# Altium project MPAXFC_00.PrjPcb (part 2 of 2)

## Sheet DEBUG.SchDoc
size A4
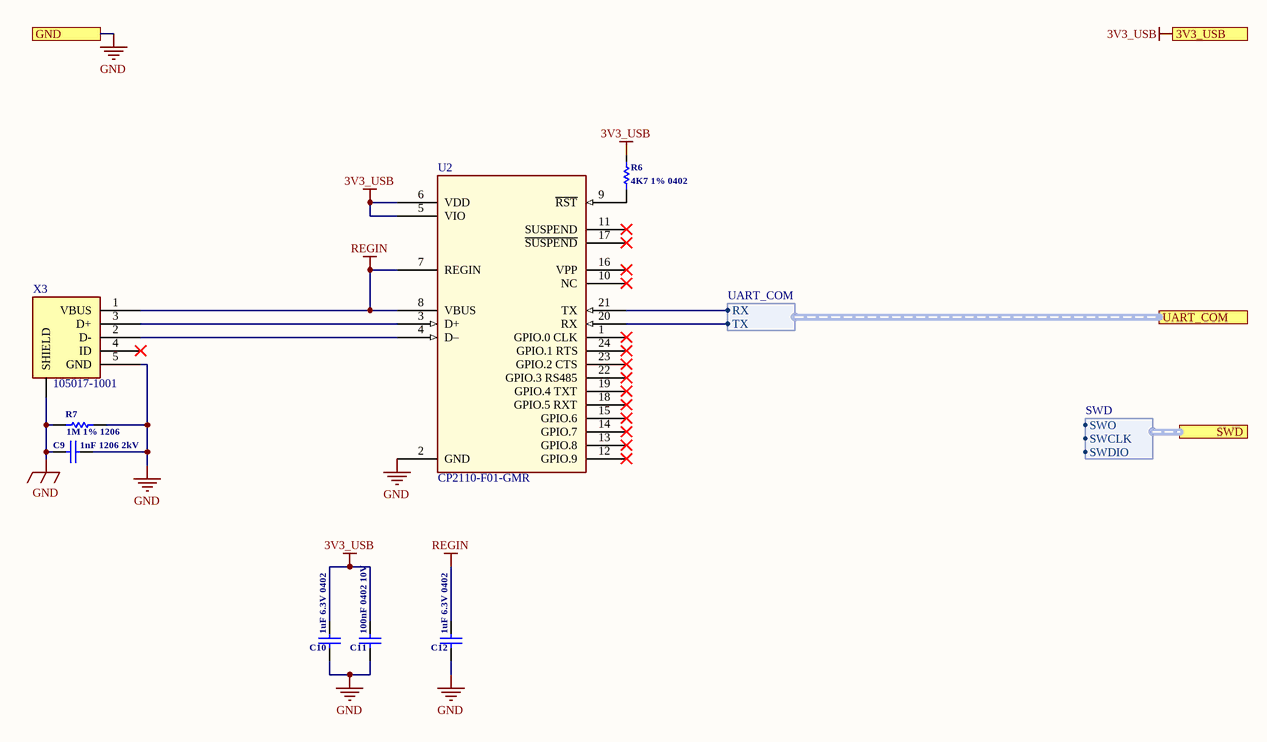
[diagram p6: DEBUG.SchDoc]

### Parts
C9  1nF 1206 2kV
C10  1uF 6.3V 0402
C11  100nF 0402 10V
C12  1uF 6.3V 0402
R6  4K7 1% 0402  [Resistor_0402]
R7  1M 1% 1206
U2  CP2110-F01-GMR
X3  105017-1001  [1050170001]

### Ports
3V3_USB (out), GND, SWD (harness SWD), UART_COM (harness UART_COM)

### Harnesses
UART_COM: TX, RX
SWD: SWDIO, SWCLK, SWO

### Nets
3V3_USB: C10.2 C11.2 U2.5(VIO) U2.6(VDD) ; port 3V3_USB  [project net +3V3_USB]
GND: C9.1 C9.2 C10.1 C11.1 C12.1 R7.1 R7.2 U2.2(GND) X3.5(GND) X3.SH1(SHIELD) ; port GND
REGIN: C12.2 U2.7(REGIN) U2.8(VBUS) X3.1(VBUS)
PB12_UART5_RX: U2.21(TX) ; port UART_COM.RX
PB13_UART5_TX: U2.20(RX) ; port UART_COM.TX
NetR6_1: R6.1 U2.9(~{RST})
NetU2_3: U2.3(D+) X3.3(D+)
NetU2_4: U2.4(D–) X3.2(D-)

Not connected (* = marked no-connect by the designer): R6 2; U2 1(GPIO.0_CLK)* 10(NC)* 11(SUSPEND)* 12(GPIO.9)* 13(GPIO.8)* 14(GPIO.7)* 15(GPIO.6)* 16(VPP)* 17(~{SUSPEND})* 18(GPIO.5_RXT)* 19(GPIO.4_TXT)* 22(GPIO.3_RS485)* 23(GPIO.2_CTS)* 24(GPIO.1_RTS)*; X3 4(ID)*

### Notes on the sheet
- Labels drawn without touching a wire or pin: 3V3_USB

### Library data of the parts
C9 = CL31B102KJHNNNE 1nF 2kV 1206: Supplier 1: Digi-Key; Supplier Part Number 1: 1276-3073-1-ND; Value: 1nF 1206 2kV
C10 C12 = CL05A105KQ5NNNC 1uF 0402: SAMSUNG ELECTRO-MECHANICS - CL05A105KQ5NNNC - SMD Multilayer Ceramic Capacitor, 1 µF, 6.3 V, 0402 [1005 Metric], ± 10%, X5R, CL Series; Capacitance: 1000000 pF; Supplier 1: Digi-Key; Manufacturer: Samsung; Manufacturer Part Number: CL05A105KQ5NNNC; Stock 1: 2633061; Pricing 1: 1=0.1, 10=0.019, 50=0.0106, 100=0.0087, 500=0.0062, 1000=0.0049, 2500=0.0044, 5000=0.0041 (USD); Case Size/Dimension: 0402; Dielectric: X5R; Tolerance (%): ±10 %; Rated Voltage: 6.3 V; ComponentLink1URL: http://www.samsungsem.com/kr/support/product-search/mlcc/CL05A105KQ5NNNC.jsp?src-supplier=Digi-Key; ComponentLink1Description: http://www.samsungsem.com/kr/support/product-search/mlcc/CL05A105KQ5NNNC.jsp?src-supplier=Digi-Key; ComponentLink2URL: http://www1.futureelectronics.com/doc/SAMSUNG%20PASSIVE/CL05B104KQ5NNNC.pdf?src-supplier=Future+Electronics; ComponentLink2Description: http://www1.futureelectronics.com/doc/SAMSUNG%20PASSIVE/CL05B104KQ5NNNC.pdf?src-supplier=Future+Electronics; ComponentLink3URL: https://www.verical.com/server-webapp/html/getDatasheet?partID=358391&src-supplier=Verical; ComponentLink3Description: https://www.verical.com/server-webapp/html/getDatasheet?partID=358391&src-supplier=Verical; ComponentLink4URL: https://produktinfo.conrad.com/datenblaetter/450000-474999/459172-da-01-en-VS_KONDENSATOR_0402.pdf?src-supplier=Conrad; ComponentLink4Description: https://produktinfo.conrad.com/datenblaetter/450000-474999/459172-da-01-en-VS_KONDENSATOR_0402.pdf?src-supplier=Conrad; Supplier Part Number 1: 1276-1010-1-ND; Value: 1uF 6.3V 0402
C11 = CL05A104KP5NNNC 100nF 0402 10V: Cap Ceramic 0.1uF 10V X5R 10% SMD 0402 85C Paper T/R; Manufacturer: Samsung; Capacitance: 100000 pF; Supplier 1: Digi-Key; Manufacturer Part Number: CL05A104KP5NNNC; Stock 1: 5595689; Pricing 1: 1=0.1, 10=0.021, 50=0.0116, 100=0.0094, 500=0.0067, 1000=0.0053, 2500=0.0048, 5000=0.0044 (USD); Case Size/Dimension: 0402; Dielectric: X5R; Tolerance (%): ±10 %; Rated Voltage: 10 V; ComponentLink1URL: https://www.distrelec.biz/Web/Downloads/_e/ng/MLCC_CatalogDownload2013_ENG.pdf?mime=application%2Fpdf&src-supplier=Distrelec; ComponentLink1Description: https://www.distrelec.biz/Web/Downloads/_e/ng/MLCC_CatalogDownload2013_ENG.pdf?mime=application%2Fpdf&src-supplier=Distrelec; ComponentLink2URL: https://media.digikey.com/pdf/Data%20Sheets/Samsung%20PDFs/CL_Series_MLCC_ds.pdf?src-supplier=Digi-Key; ComponentLink2Description: https://media.digikey.com/pdf/Data%20Sheets/Samsung%20PDFs/CL_Series_MLCC_ds.pdf?src-supplier=Digi-Key; ComponentLink3URL: http://www1.futureelectronics.com/doc/SAMSUNG%20PASSIVE/CL05B104KQ5NNNC.pdf?src-supplier=Future+Electronics; ComponentLink3Description: http://www1.futureelectronics.com/doc/SAMSUNG%20PASSIVE/CL05B104KQ5NNNC.pdf?src-supplier=Future+Electronics; ComponentLink4URL: https://www.verical.com/server-webapp/html/getDatasheet?partID=358611&src-supplier=Verical; ComponentLink4Description: https://www.verical.com/server-webapp/html/getDatasheet?partID=358611&src-supplier=Verical; Supplier Part Number 1: 1276-1022-1-ND; Value: 100nF 0402 10V
R6 = AC0402FR-074K7L 4.7K 1% 0402: Thick Film Resistors 1/16W 4.7K ohm 1% AEC-Q200; Manufacturer: Yageo; Resistance: 4.7 kOhms; Power Rating: 62.5 mW (1/16 W); Temperature Coefficient: 100 PPM / C; Voltage Rating: 50 V; Unit Weight: 0.000023 oz; Supplier 1: Digi-Key; Manufacturer Part Number: AC0402FR-074K7L; Stock 1: 3; Pricing 1: 1=0.1, 10=0.021, 100=0.0086, 1000=0.0039, 2500=0.0033, 5000=0.0028 (USD); Product Category: Thick Film Resistors; RoHS: True; Tolerance: 1 %; Case Code - in: 0402; Case Code - mm: 1005; Operating Temperature Range: - 55 C to + 155 C; Series: AC; Brand: Yageo; Height: 0.32 mm; Length: 1 mm; Package / Case: 0402 (1005 metric); Packaging: Reel; Product: Thick Film Resistors SMD; Termination Style: SMD/SMT; Type: Chip Resistor Surface Mount; Width: 0.5 mm; ComponentLink1URL: http://www.mouser.com/ds/2/447/yageodocoutput-1111992.pdf?src-supplier=Mouser; ComponentLink1Description: http://www.mouser.com/ds/2/447/yageodocoutput-1111992.pdf?src-supplier=Mouser; ComponentLink2URL: http://www.yageo.com/documents/recent/PYu-AC_51_RoHS_L_2_revised.pdf?src-supplier=Future+Electronics; ComponentLink2Description: http://www.yageo.com/documents/recent/PYu-AC_51_RoHS_L_2_revised.pdf?src-supplier=Future+Electronics; ComponentLink3URL: http://www.yageo.com/NewPortal/yageodocoutput?fileName=/pdf/R-Chip/PYu-AC_51_RoHS_L_6.pdf&src-supplier=Digi-Key; ComponentLink3Description: http://www.yageo.com/NewPortal/yageodocoutput?fileName=/pdf/R-Chip/PYu-AC_51_RoHS_L_6.pdf&src-supplier=Digi-Key; Supplier Part Number 1: YAG3497CT-ND; Value: 4K7 1% 0402
R7 = RMCF1206FT1M00 1M 1% 1206: 1 MOhms ±1% 0.25W, 1/4W Resistencia en microprocesador 1206 (3216 métrico) AEC-Q200 automotriz Película gruesa; Supplier 1: Digi-Key; Supplier Part Number 1: RMCF1206FT1M00CT-ND; Value: 1M 1% 1206
U2 = CP2110-F01-GMR: IC HID USB-TO-UART BRIDGE 24QFN; Manufacturer: Silicon Labs; Interface Type: UART; Number of I/Os: 10 I/O; Operating Supply Voltage: 3 V to 3.6 V; Operating Supply Current: 11.3 mA; Unit Weight: 0.001764 oz; Supplier 1: Digi-Key; Manufacturer Part Number: CP2110-F01-GMR; Stock 1: 2215; Pricing 1: 1=1.54, 25=1.4808, 100=1.428 (USD); Product Category: I/O Controller Interface IC; RoHS: True; Product: HID USB to UART Bridges; Maximum Operating Temperature: + 85 C; Minimum Operating Temperature: - 40 C; Mounting Style: SMD/SMT; Package / Case: QFN-24; Packaging: Reel; Brand: Silicon Labs; Series: CP2110; Supplier Part Number 1: 336-4156-1-ND
X3 = microUSB_105017-1001: Supplier 1: Digi-Key; Supplier Part Number 1: WM1399CT-ND

## Sheet ESC.SchDoc
size A4
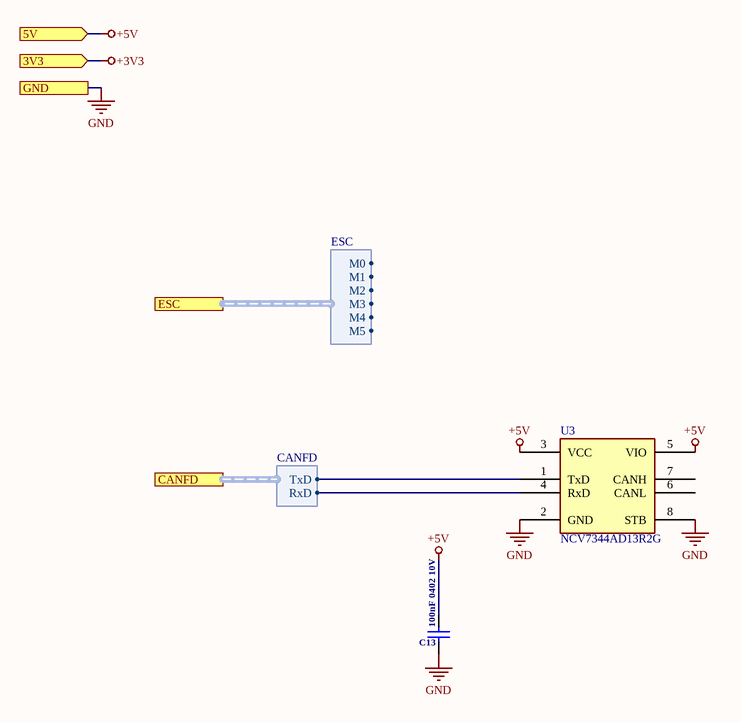
[diagram p7: ESC.SchDoc]

### Parts
C13  100nF 0402 10V
U3  NCV7344AD13R2G  [SOIC127P600X175-8N]

### Ports
3V3 (in), 5V (in), CANFD (harness CANFD), ESC (harness ESC), GND

### Harnesses
ESC: M0, M1, M2, M3, M4, M5
CANFD: TxD, RxD

### Nets
+5V: C13.2 U3.3(VCC) U3.5(VIO) ; port 5V
GND: C13.1 U3.2(GND) U3.8(STB) ; port GND
PA11_FDCAN1_RX: U3.4(RxD) ; port CANFD.RxD
PA12_FDCAN1_TX: U3.1(TxD) ; port CANFD.TxD

Not connected (* = marked no-connect by the designer): U3 6(CANL) 7(CANH)

### Library data of the parts
C13 = CL05A104KP5NNNC 100nF 0402 10V: as C11 on sheet DEBUG; Supplier 1: Digi-Key; Manufacturer Part Number: CL05A104KP5NNNC; Stock 1: 5595689; Pricing 1: 1=0.1, 10=0.021, 50=0.0116, 100=0.0094, 500=0.0067, 1000=0.0053, 2500=0.0048, 5000=0.0044 (USD); Case Size/Dimension: 0402; Dielectric: X5R; Tolerance (%): ±10 %; Rated Voltage: 10 V; ComponentLink1URL: https://www.distrelec.biz/Web/Downloads/_e/ng/MLCC_CatalogDownload2013_ENG.pdf?mime=application%2Fpdf&src-supplier=Distrelec; ComponentLink1Description: https://www.distrelec.biz/Web/Downloads/_e/ng/MLCC_CatalogDownload2013_ENG.pdf?mime=application%2Fpdf&src-supplier=Distrelec; ComponentLink2URL: https://media.digikey.com/pdf/Data%20Sheets/Samsung%20PDFs/CL_Series_MLCC_ds.pdf?src-supplier=Digi-Key; ComponentLink2Description: https://media.digikey.com/pdf/Data%20Sheets/Samsung%20PDFs/CL_Series_MLCC_ds.pdf?src-supplier=Digi-Key; ComponentLink3URL: http://www1.futureelectronics.com/doc/SAMSUNG%20PASSIVE/CL05B104KQ5NNNC.pdf?src-supplier=Future+Electronics; ComponentLink3Description: http://www1.futureelectronics.com/doc/SAMSUNG%20PASSIVE/CL05B104KQ5NNNC.pdf?src-supplier=Future+Electronics; ComponentLink4URL: https://www.verical.com/server-webapp/html/getDatasheet?partID=358611&src-supplier=Verical; ComponentLink4Description: https://www.verical.com/server-webapp/html/getDatasheet?partID=358611&src-supplier=Verical; Supplier Part Number 1: 1276-1022-1-ND; Value: 100nF 0402 10V
U3 = NCV7344AD13R2G: IC TRANSCEIVER HALF 1/1 8SOIC; Supplier 1: Digi-Key; Supplier Part Number 1: 488-NCV7344AD13R2GCT-ND

## Sheet RADIO.SchDoc
size A4
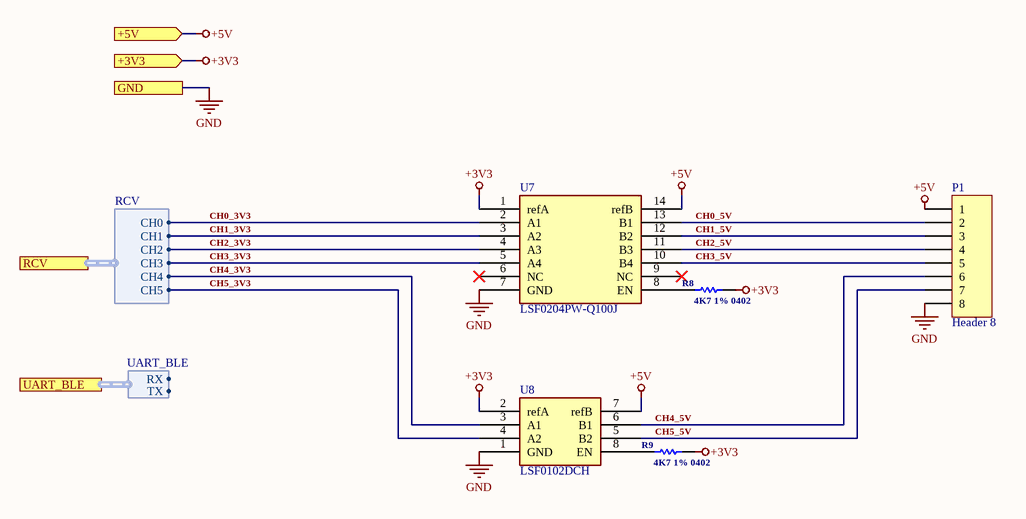
[diagram p8: RADIO.SchDoc]

### Parts
P1  Header 8  [HDR1X8]
R8  4K7 1% 0402  [Resistor_0402]
R9  4K7 1% 0402  [Resistor_0402]
U7  LSF0204PW-Q100J  [TSOP65P640X110-14N]
U8  LSF0102DCH

### Ports
+3V3 (in), +5V (in), GND, RCV (harness RCV), UART_BLE (harness UART_BLE)

### Harnesses
RCV: CH0, CH1, CH2, CH3, CH4, CH5
UART_BLE: RX, TX

### Nets
+3V3: R8.2 R9.2 U7.1(refA) U8.2(refA) ; port +3V3
+5V: P1.1 U7.14(refB) U8.7(refB) ; port +5V
GND: P1.8 U7.7(GND) U8.1(GND) ; port GND
CH0_3V3: U7.2(A1) ; port RCV.CH0
CH0_5V: P1.2 U7.13(B1)
CH1_3V3: U7.3(A2) ; port RCV.CH1
CH1_5V: P1.3 U7.12(B2)
CH2_3V3: U7.4(A3) ; port RCV.CH2
CH2_5V: P1.4 U7.11(B3)
CH3_3V3: U7.5(A4) ; port RCV.CH3
CH3_5V: P1.5 U7.10(B4)
CH4_3V3: U8.3(A1) ; port RCV.CH4
CH4_5V: P1.6 U8.6(B1)
CH5_3V3: U8.4(A2) ; port RCV.CH5
CH5_5V: P1.7 U8.5(B2)
NetR8_1: R8.1 U7.8(EN)
NetR9_1: R9.1 U8.8(EN)

Not connected (* = marked no-connect by the designer): U7 6(NC)* 9(NC)*

### Library data of the parts
P1 = Header 8: Header, 8-Pin; LatestRevisionDate: 17-Jul-2002; LatestRevisionNote: Re-released for DXP Platform.; Publisher: Altium Limited
R8 R9 = AC0402FR-074K7L 4.7K 1% 0402: as R6 on sheet DEBUG; Supplier 1: Digi-Key; Manufacturer Part Number: AC0402FR-074K7L; Stock 1: 3; Pricing 1: 1=0.1, 10=0.021, 100=0.0086, 1000=0.0039, 2500=0.0033, 5000=0.0028 (USD); Product Category: Thick Film Resistors; RoHS: True; Tolerance: 1 %; Case Code - in: 0402; Case Code - mm: 1005; Operating Temperature Range: - 55 C to + 155 C; Series: AC; Brand: Yageo; Height: 0.32 mm; Length: 1 mm; Package / Case: 0402 (1005 metric); Packaging: Reel; Product: Thick Film Resistors SMD; Termination Style: SMD/SMT; Type: Chip Resistor Surface Mount; Width: 0.5 mm; ComponentLink1URL: http://www.mouser.com/ds/2/447/yageodocoutput-1111992.pdf?src-supplier=Mouser; ComponentLink1Description: http://www.mouser.com/ds/2/447/yageodocoutput-1111992.pdf?src-supplier=Mouser; ComponentLink2URL: http://www.yageo.com/documents/recent/PYu-AC_51_RoHS_L_2_revised.pdf?src-supplier=Future+Electronics; ComponentLink2Description: http://www.yageo.com/documents/recent/PYu-AC_51_RoHS_L_2_revised.pdf?src-supplier=Future+Electronics; ComponentLink3URL: http://www.yageo.com/NewPortal/yageodocoutput?fileName=/pdf/R-Chip/PYu-AC_51_RoHS_L_6.pdf&src-supplier=Digi-Key; ComponentLink3Description: http://www.yageo.com/NewPortal/yageodocoutput?fileName=/pdf/R-Chip/PYu-AC_51_RoHS_L_6.pdf&src-supplier=Digi-Key; Supplier Part Number 1: YAG3497CT-ND; Value: 4K7 1% 0402
U7 = LSF0204PW-Q100J: Nivel de voltaje Traductores Bidireccional 1 circuitos 4 canales 120MHz 14-TSSOP; Supplier 1: Digi-Key; Supplier Part Number 1: 1727-LSF0204PW-Q100JCT-ND
U8 = LSF0102DCH: Voltage Level Translator Bidirectional 1 Circuit 2 Channel 100MHz 8-VSSOP; Supplier 1: Digi-Key; Supplier Part Number 1: 1727-LSF0102DCHCT-ND

## Nets that join several sheets
+1V8: SENSORS (7 pins), POWER (C47.2 N3.5)
+3V3: MCU (26 pins), SENSORS (14 pins), LOGGING (8 pins), GNSS (C48.2 L3.1), POWER (5 pins), RADIO (R8.2 R9.2 U7.1 U8.2)
+3V3A: MCU (6 pins), POWER (5 pins)
+5V: POWER (5 pins), ESC (C13.2 U3.3 U3.5), RADIO (P1.1 U7.14 U8.7)
ADC1_INP2: MCU (U6.49), POWER (C40.2 R14.2 R16.2)
GND: MCU (31 pins), SENSORS (12 pins), LOGGING (C1.1 C2.1 X2.6 X2.10), GNSS (7 pins), POWER (20 pins), DEBUG (10 pins), ESC (C13.1 U3.2 U3.8), RADIO (P1.8 U7.7 U8.1)
NRST: MCU (U6.25), POWER (B1.3 C53.2 R21.1)
PA0_UART4_TX: MCU (U6.34), GNSS (C56.2 U5.3)
PA1_UART4_RX: MCU (U6.35), GNSS (C57.2 U5.2)
PA11_FDCAN1_RX: MCU (U6.103), ESC (U3.4)
PA12_FDCAN1_TX: MCU (U6.104), ESC (U3.1)
PB12_UART5_RX: MCU (U6.73), DEBUG (U2.21)
PB13_UART5_TX: MCU (U6.74), DEBUG (U2.20)